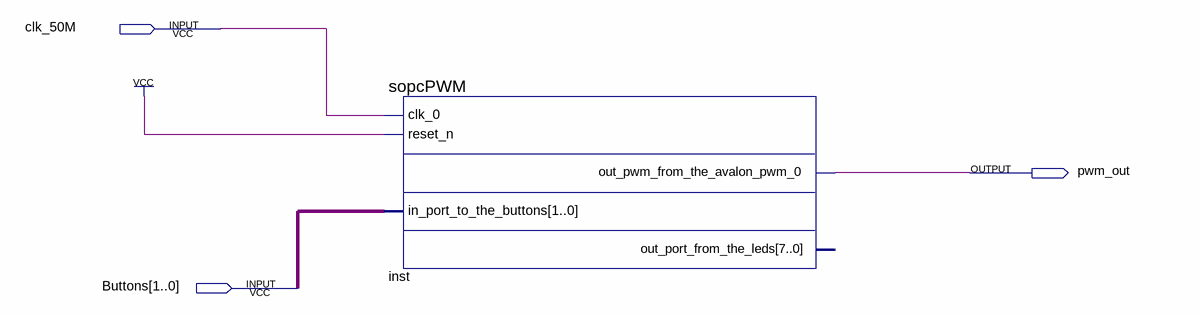
[diagram p0: schematic sheet]
// Quartus schematic mon_sopc.bdf as structural Verilog: 1 symbols, 3 pins
module mon_sopc (
  input  clk_50M,
  input  [1:0] Buttons,
  output pwm_out
);

  sopcPWM inst (
    .clk_0(clk_50M), .reset_n(1'b1), .in_port_to_the_buttons(Buttons), .out_pwm_from_the_avalon_pwm_0(pwm_out));  // open: out_port_from_the_leds
endmodule
